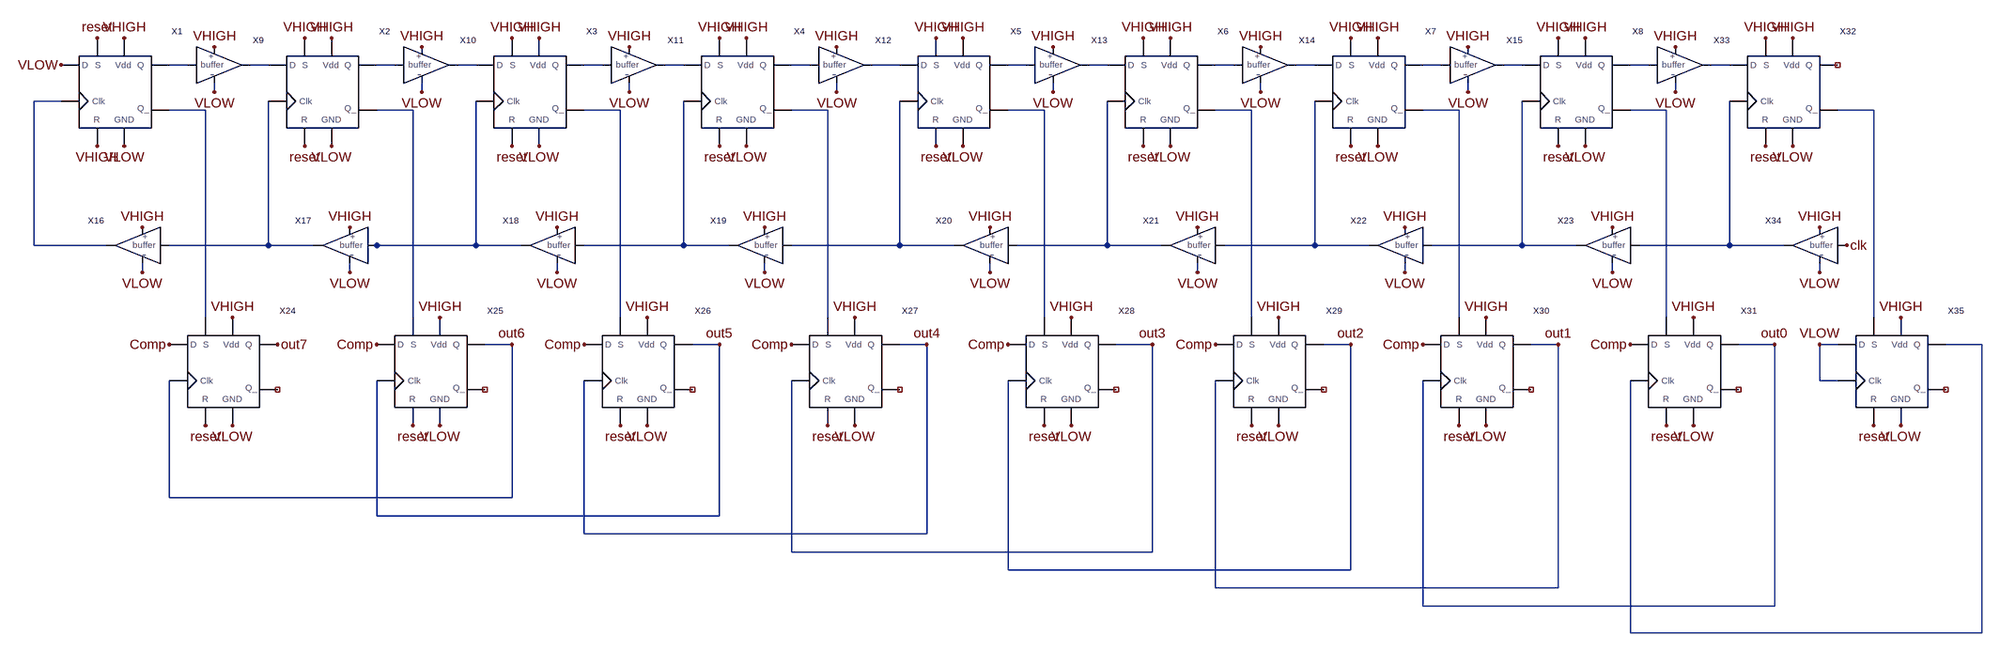
[diagram p0: schematic SAR.asc]
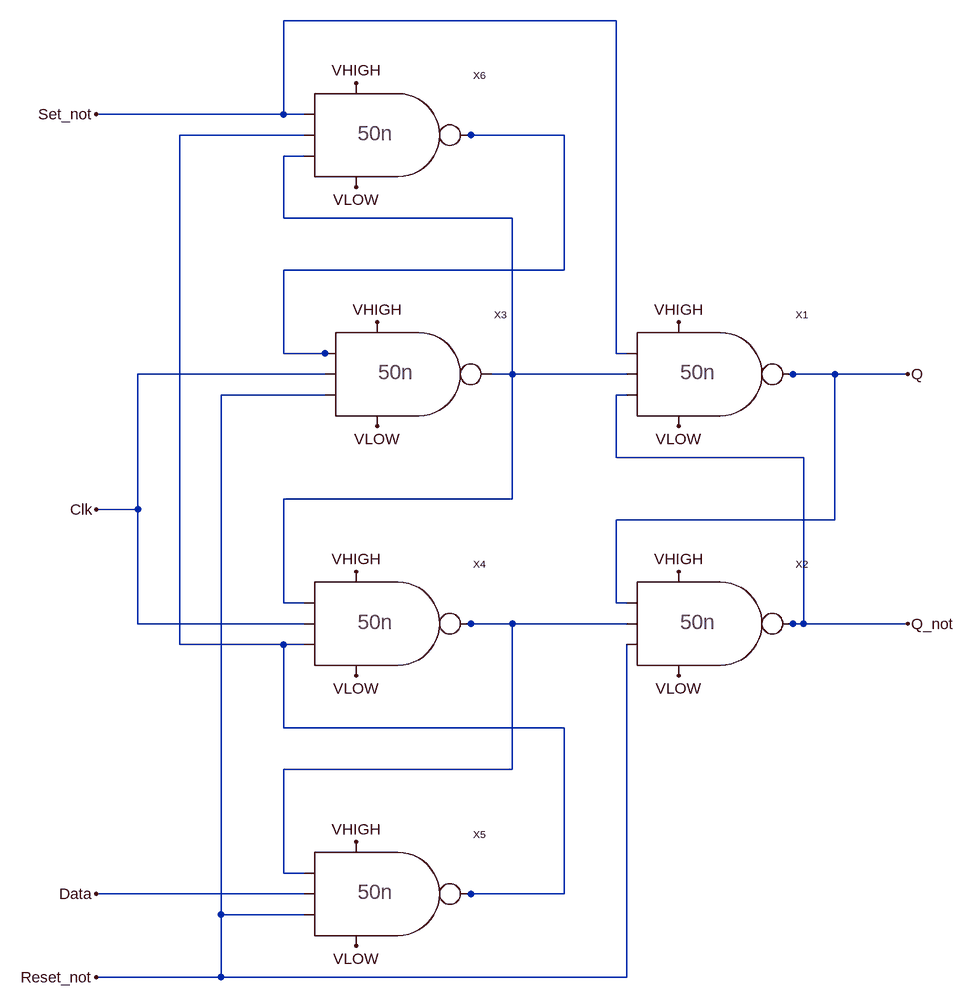
[diagram p1: sub-circuit ti_dff.asc]
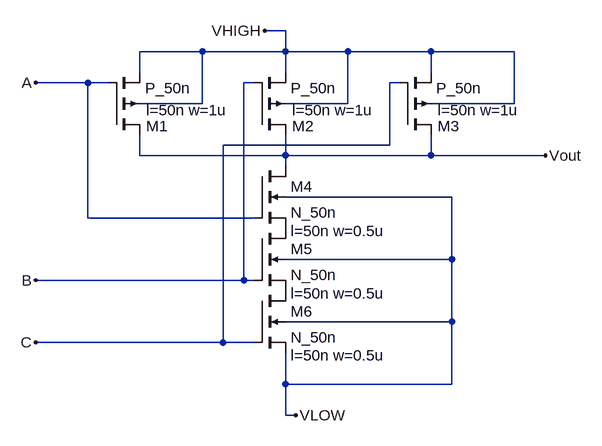
[diagram p2: sub-circuit nand3.asc]
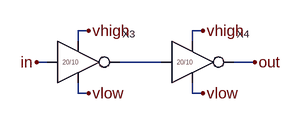
[diagram p3: sub-circuit invbuffer.asc]
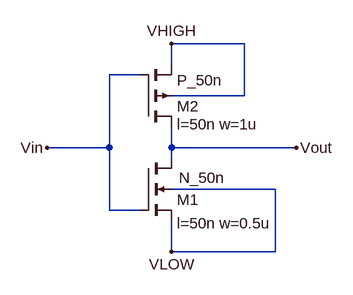
[diagram p4: sub-circuit inverter.asc]
SAR.asc, the LTspice schematic file:
Version 4
SHEET 1 4048 2004
WIRE 192 128 160 128
WIRE 336 128 304 128
WIRE 560 128 528 128
WIRE 704 128 672 128
WIRE 928 128 896 128
WIRE 1072 128 1040 128
WIRE 1296 128 1264 128
WIRE 1456 128 1408 128
WIRE 1680 128 1648 128
WIRE 1824 128 1792 128
WIRE 2048 128 2016 128
WIRE 2192 128 2160 128
WIRE 2416 128 2384 128
WIRE 2560 128 2528 128
WIRE 2784 128 2752 128
WIRE 2928 128 2896 128
WIRE 240 176 240 160
WIRE 608 176 608 160
WIRE 976 176 976 160
WIRE 1344 176 1344 160
WIRE 1728 176 1728 160
WIRE 2096 176 2096 160
WIRE 2464 176 2464 160
WIRE 2832 176 2832 160
WIRE -32 192 -80 192
WIRE 224 208 160 208
WIRE 592 208 528 208
WIRE 960 208 896 208
WIRE 1328 208 1264 208
WIRE 1712 208 1648 208
WIRE 2080 208 2016 208
WIRE 2448 208 2384 208
WIRE 2816 208 2752 208
WIRE 3184 208 3120 208
WIRE -80 448 -80 192
WIRE 48 448 -80 448
WIRE 336 448 336 192
WIRE 336 448 160 448
WIRE 416 448 336 448
WIRE 528 448 512 448
WIRE 704 448 704 192
WIRE 704 448 528 448
WIRE 784 448 704 448
WIRE 1072 448 1072 192
WIRE 1072 448 896 448
WIRE 1152 448 1072 448
WIRE 1456 448 1456 192
WIRE 1456 448 1264 448
WIRE 1552 448 1456 448
WIRE 1824 448 1824 192
WIRE 1824 448 1664 448
WIRE 1920 448 1824 448
WIRE 2192 448 2192 192
WIRE 2192 448 2032 448
WIRE 2288 448 2192 448
WIRE 2560 448 2560 192
WIRE 2560 448 2400 448
WIRE 2656 448 2560 448
WIRE 2928 448 2928 192
WIRE 2928 448 2768 448
WIRE 3024 448 2928 448
WIRE 112 496 112 480
WIRE 480 496 480 480
WIRE 848 496 848 480
WIRE 1216 496 1216 480
WIRE 1616 496 1616 480
WIRE 1984 496 1984 480
WIRE 2352 496 2352 480
WIRE 2720 496 2720 480
WIRE 3088 496 3088 480
WIRE 224 576 224 208
WIRE 592 576 592 208
WIRE 960 576 960 208
WIRE 1328 576 1328 208
WIRE 1712 576 1712 208
WIRE 2080 576 2080 208
WIRE 2448 576 2448 208
WIRE 2816 576 2816 208
WIRE 3184 576 3184 208
WIRE 768 624 720 624
WIRE 1136 624 1088 624
WIRE 1504 624 1456 624
WIRE 1904 624 1840 624
WIRE 2256 624 2208 624
WIRE 2624 624 2576 624
WIRE 3008 624 2944 624
WIRE 3120 624 3088 624
WIRE 3376 624 3312 624
WIRE 3088 688 3088 624
WIRE 3120 688 3088 688
WIRE 160 896 160 688
WIRE 768 896 768 624
WIRE 768 896 160 896
WIRE 528 928 528 688
WIRE 1136 928 1136 624
WIRE 1136 928 528 928
WIRE 896 960 896 688
WIRE 1504 960 1504 624
WIRE 1504 960 896 960
WIRE 1264 992 1264 688
WIRE 1904 992 1904 624
WIRE 1904 992 1264 992
WIRE 1648 1024 1648 688
WIRE 2256 1024 2256 624
WIRE 2256 1024 1648 1024
WIRE 2016 1056 2016 688
WIRE 2624 1056 2624 624
WIRE 2624 1056 2016 1056
WIRE 2384 1088 2384 688
WIRE 3008 1088 3008 624
WIRE 3008 1088 2384 1088
WIRE 2752 1136 2752 688
WIRE 3376 1136 3376 624
WIRE 3376 1136 2752 1136
FLAG 80 272 VLOW
FLAG 240 176 VLOW
FLAG 608 176 VLOW
FLAG 976 176 VLOW
FLAG 448 272 VLOW
FLAG 816 272 VLOW
FLAG 1184 272 VLOW
FLAG 1344 176 VLOW
FLAG 1568 272 VLOW
FLAG 1728 176 VLOW
FLAG 1936 272 VLOW
FLAG 2096 176 VLOW
FLAG 2304 272 VLOW
FLAG 2464 176 VLOW
FLAG 2672 272 VLOW
FLAG 2720 496 VLOW
FLAG 2352 496 VLOW
FLAG 1984 496 VLOW
FLAG 1616 496 VLOW
FLAG 112 496 VLOW
FLAG 480 496 VLOW
FLAG 848 496 VLOW
FLAG 1216 496 VLOW
FLAG 272 768 VLOW
FLAG 640 768 VLOW
FLAG 1008 768 VLOW
FLAG 1376 768 VLOW
FLAG 1760 768 VLOW
FLAG 2128 768 VLOW
FLAG 2496 768 VLOW
FLAG 2864 768 VLOW
FLAG 80 80 VHIGH
FLAG 240 96 VHIGH
FLAG 448 80 VHIGH
FLAG 608 96 VHIGH
FLAG 816 80 VHIGH
FLAG 976 96 VHIGH
FLAG 1184 80 VHIGH
FLAG 1344 96 VHIGH
FLAG 1568 80 VHIGH
FLAG 1728 96 VHIGH
FLAG 1936 80 VHIGH
FLAG 2096 96 VHIGH
FLAG 2304 80 VHIGH
FLAG 2464 96 VHIGH
FLAG 2672 80 VHIGH
FLAG 112 416 VHIGH
FLAG 480 416 VHIGH
FLAG 848 416 VHIGH
FLAG 1216 416 VHIGH
FLAG 1616 416 VHIGH
FLAG 1984 416 VHIGH
FLAG 2352 416 VHIGH
FLAG 2720 416 VHIGH
FLAG 272 576 VHIGH
FLAG 640 576 VHIGH
FLAG 1008 576 VHIGH
FLAG 1376 576 VHIGH
FLAG 1760 576 VHIGH
FLAG 2128 576 VHIGH
FLAG 2496 576 VHIGH
FLAG 2864 576 VHIGH
FLAG 3136 448 clk
FLAG 32 272 VHIGH
FLAG 32 80 reset
FLAG 400 272 reset
FLAG 768 272 reset
FLAG 1136 272 reset
FLAG 1520 272 reset
FLAG 1888 272 reset
FLAG 2256 272 reset
FLAG 2624 272 reset
FLAG 400 80 VHIGH
FLAG 768 80 VHIGH
FLAG 1136 80 VHIGH
FLAG 1520 80 VHIGH
FLAG 1888 80 VHIGH
FLAG 2256 80 VHIGH
FLAG 2624 80 VHIGH
FLAG 160 624 Comp
FLAG 528 624 Comp
FLAG 896 624 Comp
FLAG 1264 624 Comp
FLAG 1648 624 Comp
FLAG 2016 624 Comp
FLAG 2384 624 Comp
FLAG 2752 624 Comp
FLAG 224 768 reset
FLAG 592 768 reset
FLAG 960 768 reset
FLAG 1328 768 reset
FLAG 1712 768 reset
FLAG 2080 768 reset
FLAG 2448 768 reset
FLAG 2816 768 reset
FLAG -32 128 VLOW
FLAG 352 624 out7
FLAG 768 624 out6
FLAG 1136 624 out5
FLAG 1504 624 out4
FLAG 1904 624 out3
FLAG 2256 624 out2
FLAG 2624 624 out1
FLAG 2832 176 VLOW
FLAG 3040 272 VLOW
FLAG 3088 496 VLOW
FLAG 2832 96 VHIGH
FLAG 3040 80 VHIGH
FLAG 3088 416 VHIGH
FLAG 2992 272 reset
FLAG 2992 80 VHIGH
FLAG 3232 768 VLOW
FLAG 3232 576 VHIGH
FLAG 3184 768 reset
FLAG 3088 624 VLOW
FLAG 3008 624 out0
SYMBOL TI_DFF 64 176 R0
SYMATTR InstName X1
SYMBOL TI_DFF 432 176 R0
SYMATTR InstName X2
SYMBOL TI_DFF 800 176 R0
SYMATTR InstName X3
SYMBOL TI_DFF 1168 176 R0
SYMATTR InstName X4
SYMBOL TI_DFF 1552 176 R0
SYMATTR InstName X5
SYMBOL TI_DFF 1920 176 R0
SYMATTR InstName X6
SYMBOL TI_DFF 2288 176 R0
SYMATTR InstName X7
SYMBOL TI_DFF 2656 176 R0
SYMATTR InstName X8
SYMBOL invBuffer 240 128 R0
SYMATTR InstName X9
SYMBOL invBuffer 608 128 R0
SYMATTR InstName X10
SYMBOL invBuffer 976 128 R0
SYMATTR InstName X11
SYMBOL invBuffer 1344 128 R0
SYMATTR InstName X12
SYMBOL invBuffer 1728 128 R0
SYMATTR InstName X13
SYMBOL invBuffer 2096 128 R0
SYMATTR InstName X14
SYMBOL invBuffer 2464 128 R0
SYMATTR InstName X15
SYMBOL invBuffer 112 448 M0
SYMATTR InstName X16
SYMBOL invBuffer 480 448 M0
SYMATTR InstName X17
SYMBOL invBuffer 848 448 M0
SYMATTR InstName X18
SYMBOL invBuffer 1216 448 M0
SYMATTR InstName X19
SYMBOL invBuffer 1616 448 M0
SYMATTR InstName X20
SYMBOL invBuffer 1984 448 M0
SYMATTR InstName X21
SYMBOL invBuffer 2352 448 M0
SYMATTR InstName X22
SYMBOL invBuffer 2720 448 M0
SYMATTR InstName X23
SYMBOL TI_DFF 256 672 R0
SYMATTR InstName X24
SYMBOL TI_DFF 624 672 R0
SYMATTR InstName X25
SYMBOL TI_DFF 992 672 R0
SYMATTR InstName X26
SYMBOL TI_DFF 1360 672 R0
SYMATTR InstName X27
SYMBOL TI_DFF 1744 672 R0
SYMATTR InstName X28
SYMBOL TI_DFF 2112 672 R0
SYMATTR InstName X29
SYMBOL TI_DFF 2480 672 R0
SYMATTR InstName X30
SYMBOL TI_DFF 2848 672 R0
SYMATTR InstName X31
SYMBOL TI_DFF 3024 176 R0
SYMATTR InstName X32
SYMBOL invBuffer 2832 128 R0
SYMATTR InstName X33
SYMBOL invBuffer 3088 448 M0
SYMATTR InstName X34
SYMBOL TI_DFF 3216 672 R0
SYMATTR InstName X35

ti_dff.asc, the sub-circuit schematic file:
Version 4
SHEET 1 1216 1124
WIRE 160 -416 -352 -416
WIRE -352 -272 -352 -416
WIRE -352 -272 -640 -272
WIRE -320 -272 -352 -272
WIRE -320 -240 -512 -240
WIRE -64 -240 -80 -240
WIRE 80 -240 -64 -240
WIRE -320 -208 -352 -208
WIRE -352 -112 -352 -208
WIRE 0 -112 -352 -112
WIRE 80 -32 80 -240
WIRE 80 -32 -352 -32
WIRE -352 96 -352 -32
WIRE -288 96 -352 96
WIRE -272 96 -288 96
WIRE 160 96 160 -416
WIRE 176 96 160 96
WIRE -288 128 -576 128
WIRE 0 128 0 -112
WIRE 0 128 -32 128
WIRE 176 128 0 128
WIRE 432 128 416 128
WIRE 496 128 432 128
WIRE 608 128 496 128
WIRE -288 160 -448 160
WIRE 176 160 160 160
WIRE 160 256 160 160
WIRE 448 256 160 256
WIRE 0 320 0 128
WIRE 0 320 -352 320
WIRE -576 336 -576 128
WIRE -576 336 -640 336
WIRE 496 352 496 128
WIRE 496 352 160 352
WIRE -352 480 -352 320
WIRE -320 480 -352 480
WIRE 160 480 160 352
WIRE 176 480 160 480
WIRE -576 512 -576 336
WIRE -320 512 -576 512
WIRE -64 512 -80 512
WIRE 0 512 -64 512
WIRE 176 512 0 512
WIRE 432 512 416 512
WIRE 448 512 448 256
WIRE 448 512 432 512
WIRE 608 512 448 512
WIRE -512 544 -512 -240
WIRE -352 544 -512 544
WIRE -320 544 -352 544
WIRE -352 672 -352 544
WIRE 80 672 -352 672
WIRE 0 736 0 512
WIRE 0 736 -352 736
WIRE -352 896 -352 736
WIRE -320 896 -352 896
WIRE -320 928 -640 928
WIRE -64 928 -80 928
WIRE 80 928 80 672
WIRE 80 928 -64 928
WIRE -448 960 -448 160
WIRE -320 960 -448 960
WIRE -448 1056 -448 960
WIRE -448 1056 -640 1056
WIRE 176 1056 176 544
WIRE 176 1056 -448 1056
FLAG -640 -272 Set_not
FLAG -640 928 Data
FLAG -640 336 Clk
FLAG -640 1056 Reset_not
FLAG 608 128 Q
FLAG 608 512 Q_not
FLAG -240 848 VHIGH
FLAG -240 432 VHIGH
FLAG 256 432 VHIGH
FLAG -240 -320 VHIGH
FLAG -208 48 VHIGH
FLAG 256 48 VHIGH
FLAG -240 -160 VLOW
FLAG -208 208 VLOW
FLAG 256 208 VLOW
FLAG -240 1008 VLOW
FLAG 256 592 VLOW
FLAG -240 592 VLOW
SYMBOL NAND3 240 128 R0
SYMATTR InstName X1
SYMBOL NAND3 240 512 R0
SYMATTR InstName X2
SYMBOL NAND3 -224 128 R0
SYMATTR InstName X3
SYMBOL NAND3 -256 512 R0
SYMATTR InstName X4
SYMBOL NAND3 -256 928 R0
SYMATTR InstName X5
SYMBOL NAND3 -256 -240 R0
SYMATTR InstName X6

nand3.asc, the sub-circuit schematic file:
Version 4
SHEET 1 880 788
WIRE 320 -96 288 -96
WIRE 192 -64 96 -64
WIRE 320 -64 320 -96
WIRE 320 -64 192 -64
WIRE 416 -64 320 -64
WIRE 544 -64 416 -64
WIRE 672 -64 544 -64
WIRE 96 -32 96 -64
WIRE 320 -32 320 -64
WIRE 544 -32 544 -64
WIRE 16 -16 -64 -16
WIRE 48 -16 16 -16
WIRE 272 -16 256 -16
WIRE 496 -16 480 -16
WIRE 192 16 192 -64
WIRE 192 16 96 16
WIRE 416 16 416 -64
WIRE 416 16 320 16
WIRE 672 16 672 -64
WIRE 672 16 544 16
WIRE 480 80 480 -16
WIRE 480 80 224 80
WIRE 96 96 96 64
WIRE 320 96 320 64
WIRE 320 96 96 96
WIRE 544 96 544 64
WIRE 544 96 320 96
WIRE 720 96 544 96
WIRE 320 112 320 96
WIRE 576 160 320 160
WIRE 16 192 16 -16
WIRE 272 192 16 192
WIRE 576 256 576 160
WIRE 576 256 320 256
WIRE 256 288 256 -16
WIRE 256 288 -64 288
WIRE 272 288 256 288
WIRE 576 352 576 256
WIRE 576 352 320 352
WIRE 224 384 224 80
WIRE 224 384 -64 384
WIRE 272 384 224 384
WIRE 320 448 320 400
WIRE 576 448 576 352
WIRE 576 448 320 448
WIRE 320 496 320 448
WIRE 336 496 320 496
FLAG -64 -16 A
FLAG -64 288 B
FLAG -64 384 C
FLAG 720 96 Vout
FLAG 288 -96 VHIGH
FLAG 336 496 VLOW
SYMBOL pmos4 272 64 M180
WINDOW 0 58 13 Left 2
WINDOW 123 58 38 Left 2
SYMATTR InstName M2
SYMATTR Value2 l=50n w=1u
SYMATTR Value P_50n
SYMBOL pmos4 48 64 M180
WINDOW 0 58 13 Left 2
WINDOW 123 58 38 Left 2
SYMATTR InstName M1
SYMATTR Value2 l=50n w=1u
SYMATTR Value P_50n
SYMBOL pmos4 496 64 M180
WINDOW 0 58 13 Left 2
WINDOW 123 58 38 Left 2
SYMATTR InstName M3
SYMATTR Value2 l=50n w=1u
SYMATTR Value P_50n
SYMBOL nmos4 272 112 R0
WINDOW 123 56 100 Left 2
SYMATTR Value2 l=50n w=0.5u
SYMATTR InstName M4
SYMATTR Value N_50n
SYMBOL nmos4 272 208 R0
WINDOW 123 56 100 Left 2
SYMATTR Value2 l=50n w=0.5u
SYMATTR InstName M5
SYMATTR Value N_50n
SYMBOL nmos4 272 304 R0
WINDOW 123 56 100 Left 2
SYMATTR Value2 l=50n w=0.5u
SYMATTR InstName M6
SYMATTR Value N_50n

invbuffer.asc, the sub-circuit schematic file:
Version 4
SHEET 1 880 680
WIRE 64 96 48 96
WIRE 240 96 224 96
WIRE 48 112 48 96
WIRE 224 112 224 96
WIRE 0 144 -16 144
WIRE 176 144 112 144
WIRE 320 144 288 144
WIRE 48 192 48 176
WIRE 64 192 48 192
WIRE 224 192 224 176
WIRE 240 192 224 192
FLAG -16 144 in
FLAG 320 144 out
FLAG 64 96 vhigh
FLAG 240 96 vhigh
FLAG 64 192 vlow
FLAG 240 192 vlow
SYMBOL Inverter 16 144 R0
SYMATTR InstName X3
SYMBOL Inverter 192 144 R0
SYMATTR InstName X4

inverter.asc, the sub-circuit schematic file:
Version 4
SHEET 1 880 680
WIRE 336 -64 224 -64
WIRE 224 -32 224 -64
WIRE 176 -16 128 -16
WIRE 336 16 336 -64
WIRE 336 16 224 16
WIRE 128 96 128 -16
WIRE 128 96 32 96
WIRE 224 96 224 64
WIRE 416 96 224 96
WIRE 224 112 224 96
WIRE 384 160 224 160
WIRE 128 192 128 96
WIRE 176 192 128 192
WIRE 224 256 224 208
WIRE 384 256 384 160
WIRE 384 256 224 256
FLAG 32 96 Vin
FLAG 224 256 VLOW
FLAG 224 -64 VHIGH
FLAG 416 96 Vout
SYMBOL nmos4 176 112 R0
WINDOW 123 56 100 Left 2
WINDOW 0 56 64 Left 2
WINDOW 3 59 30 Left 2
SYMATTR Value2 l=50n w=0.5u
SYMATTR InstName M1
SYMATTR Value N_50n
SYMBOL pmos4 176 64 M180
WINDOW 123 56 4 Left 2
SYMATTR Value2 l=50n w=1u
SYMATTR InstName M2
SYMATTR Value P_50n

The netlist it stands for:
* SAR.asc
XX1 reset N017 VLOW VHIGH N001 N018 VLOW VHIGH ti_dff
XX2 VHIGH N027 N002 reset N003 N019 VLOW VHIGH ti_dff
XX3 VHIGH N028 N004 reset N005 N020 VLOW VHIGH ti_dff
XX4 VHIGH N029 N006 reset N007 N021 VLOW VHIGH ti_dff
XX5 VHIGH N030 N008 reset N009 N022 VLOW VHIGH ti_dff
XX6 VHIGH N031 N010 reset N011 N023 VLOW VHIGH ti_dff
XX7 VHIGH N032 N012 reset N013 N024 VLOW VHIGH ti_dff
XX8 VHIGH N033 N014 reset N015 N025 VLOW VHIGH ti_dff
XX9 N001 N002 VHIGH VLOW invbuffer
XX10 N003 N004 VHIGH VLOW invbuffer
XX11 N005 N006 VHIGH VLOW invbuffer
XX12 N007 N008 VHIGH VLOW invbuffer
XX13 N009 N010 VHIGH VLOW invbuffer
XX14 N011 N012 VHIGH VLOW invbuffer
XX15 N013 N014 VHIGH VLOW invbuffer
XX16 N027 N017 VHIGH VLOW invbuffer
XX17 N028 N027 VHIGH VLOW invbuffer
XX18 N029 N028 VHIGH VLOW invbuffer
XX19 N030 N029 VHIGH VLOW invbuffer
XX20 N031 N030 VHIGH VLOW invbuffer
XX21 N032 N031 VHIGH VLOW invbuffer
XX22 N033 N032 VHIGH VLOW invbuffer
XX23 N034 N033 VHIGH VLOW invbuffer
XX24 N018 out6 Comp reset out7 NC_01 VLOW VHIGH ti_dff
XX25 N019 out5 Comp reset out6 NC_02 VLOW VHIGH ti_dff
XX26 N020 out4 Comp reset out5 NC_03 VLOW VHIGH ti_dff
XX27 N021 out3 Comp reset out4 NC_04 VLOW VHIGH ti_dff
XX28 N022 out2 Comp reset out3 NC_05 VLOW VHIGH ti_dff
XX29 N023 out1 Comp reset out2 NC_06 VLOW VHIGH ti_dff
XX30 N024 out0 Comp reset out1 NC_07 VLOW VHIGH ti_dff
XX31 N025 N035 Comp reset out0 NC_08 VLOW VHIGH ti_dff
XX32 VHIGH N034 N016 reset NC_09 N026 VLOW VHIGH ti_dff
XX33 N015 N016 VHIGH VLOW invbuffer
XX34 clk N034 VHIGH VLOW invbuffer
XX35 N026 VLOW VLOW reset N035 NC_10 VLOW VHIGH ti_dff

* block symbol definitions
.subckt ti_dff Set_not Clk Data Reset_not Q Q_not VLOW VHIGH
XX1 Set_not N003 Q_not Q VHIGH VLOW nand3
XX2 Q N004 Reset_not Q_not VHIGH VLOW nand3
XX3 N002 Clk Reset_not N003 VHIGH VLOW nand3
XX4 N003 Clk N001 N004 VHIGH VLOW nand3
XX5 N004 Data Reset_not N001 VHIGH VLOW nand3
XX6 Set_not N001 N003 N002 VHIGH VLOW nand3
.ends ti_dff

.subckt nand3 A B C Vout VHIGH VLOW
M2 Vout B VHIGH VHIGH P_50n l=50n w=1u
M1 Vout A VHIGH VHIGH P_50n l=50n w=1u
M3 Vout C VHIGH VHIGH P_50n l=50n w=1u
M4 Vout A P001 VLOW N_50n l=50n w=0.5u
M5 P001 B P002 VLOW N_50n l=50n w=0.5u
M6 P002 C VLOW VLOW N_50n l=50n w=0.5u
.ends nand3

.subckt invbuffer in out vhigh vlow
XX3 vhigh vlow in N001 inverter
XX4 vhigh vlow N001 out inverter
.ends invbuffer

.subckt inverter VHIGH VLOW Vin Vout
M1 Vout Vin VLOW VLOW N_50n l=50n w=0.5u
M2 Vout Vin VHIGH VHIGH P_50n l=50n w=1u
.ends inverter

.model NMOS NMOS
.model PMOS PMOS
.lib standard.mos
.backanno
.end